# EAGLE schematic teleinfo2020 (EAGLE 9.1.0)
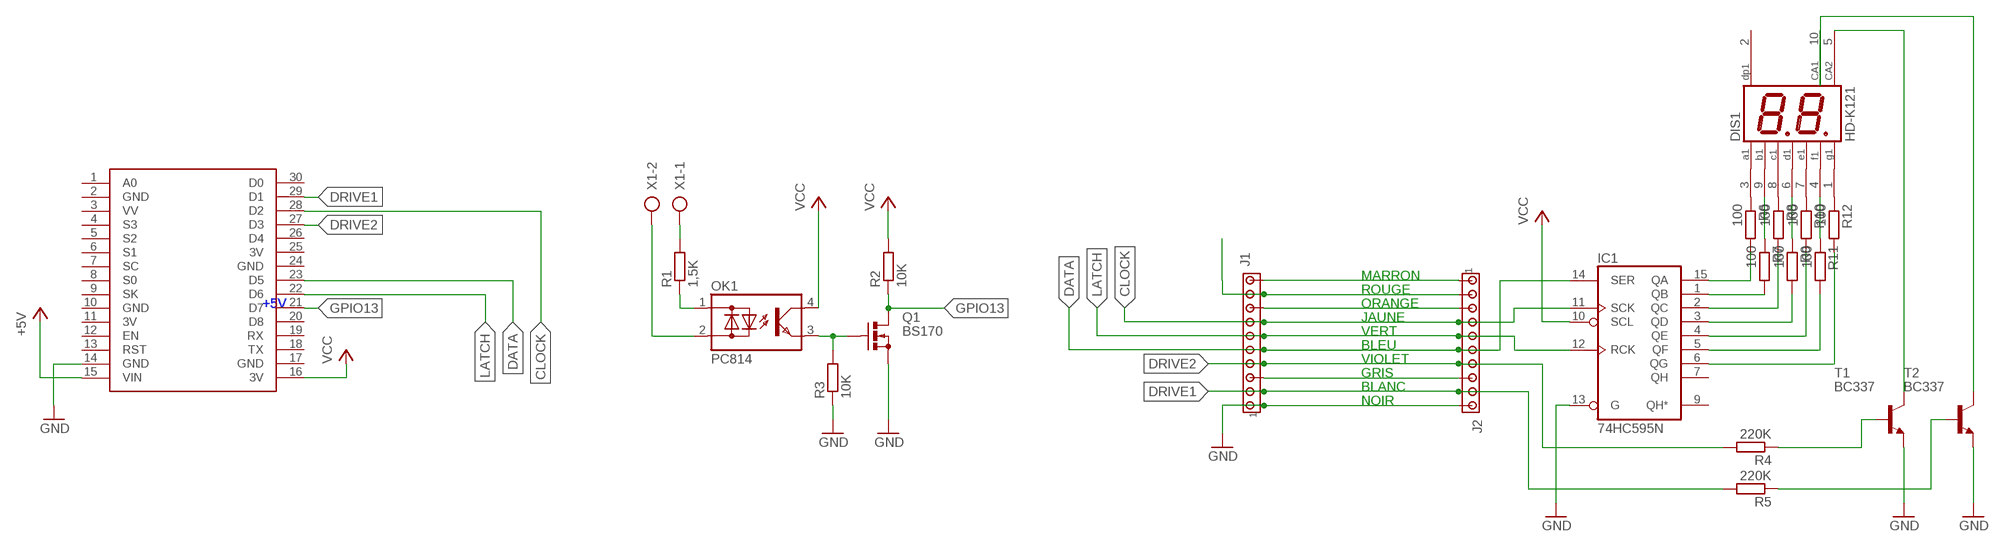
[diagram p0: schematic, sheet 1]

## Parts
DIS1  HD-K121  [HDSP-R]
IC1  74HC595N  [DIL16]
J1  MTA10-100  [10X10MTA]
J2  MTA10-100  [10X10MTA]
OK1  PC814  [DIL04]
Q1  BS170  [SOT54E]
R1  1,5K  R-EU_0204/7  [0204/7]
R2  10K  R-EU_0204/7  [0204/7]
R3  10K  R-EU_0204/7  [0204/7]
R4  220K  R-EU_0204/7  [0204/7]
R5  220K  R-EU_0204/7  [0204/7]
R6  100  R-EU_0204/7  [0204/7]
R7  100  R-EU_0204/7  [0204/7]
R8  100  R-EU_0204/7  [0204/7]
R9  100  R-EU_0204/7  [0204/7]
R10  100  R-EU_0204/7  [0204/7]
R11  100  R-EU_0204/7  [0204/7]
R12  100  R-EU_0204/7  [0204/7]
T1  BC337  [TO92]
T2  BC337  [TO92]
U$1  NODEMCU  [NODEMCU]
X1  AK300/2  [AK300/2]

## Nets
+5V: U$1.15(VIN)
CLOCK: IC1.11(SCK) J1.7 J2.4 U$1.28(D2)
DATA: IC1.14(SER) J1.5 J2.6 U$1.23(D5)
DRIVE1: J1.2 J2.9 R5.2 U$1.29(D1)
DRIVE2: J1.4 J2.7 R4.2 U$1.27(D3)
GND: IC1.13(G) J1.1 J2.10 Q1.S R3.1 T1.1(E) T2.1(E) U$1.14(GND)
GPIO13: Q1.D R2.1
LATCH: IC1.12(RCK) J1.6 J2.5 U$1.22(D6)
N$1: R1.2 X1.1
N$2: OK1.1(AC1) R1.1
N$3: OK1.2(AC2) X1.2
N$4: OK1.3(E) Q1.G R3.2
N$5: U$1.21(D7)
N$6: DIS1.5(CA2) T1.3(C)
N$7: J1.10 J2.1
N$8: IC1.15(QA) R6.2
N$9: J1.8 J2.3
N$10: DIS1.3(A1) R6.1
N$11: IC1.1(QB) R7.2
N$12: IC1.2(QC) R8.2
N$13: IC1.3(QD) R9.2
N$14: J1.3 J2.8
N$15: IC1.4(QE) R10.2
N$16: IC1.5(QF) R11.2
N$17: IC1.6(QG) R12.2
N$18: R4.1 T1.2(B)
N$19: R5.1 T2.2(B)
N$20: J1.9 J2.2
N$21: DIS1.10(CA1) T2.3(C)
N$22: DIS1.8(C1) R8.1
N$23: DIS1.7(E1) R10.1
N$24: DIS1.1(G1) R12.1
N$25: DIS1.9(B1) R7.1
N$26: DIS1.6(D1) R9.1
N$27: DIS1.4(F1) R11.1
VCC: IC1.10(SCL) OK1.4(C) R2.2 U$1.16(3V)
Unconnected: DIS1.2(DP1) IC1.7(QH) IC1.9(QH*) U$1.1(A0) U$1.3(VV) U$1.4(S3) U$1.5(S2) U$1.6(S1) U$1.7(SC) U$1.8(S0) U$1.9(SK) U$1.12(EN) U$1.13(RST) U$1.18(TX) U$1.19(RX) U$1.20(D8) U$1.26(D4) U$1.30(D0)

## Notes on the sheet
- MARRON
- ROUGE
- ORANGE
- JAUNE
- VERT
- BLEU
- VIOLET
- GRIS
- BLANC
- NOIR

## Power pins joined to a net without a drawn wire
3V: U$1.11(3V) U$1.25(3V)
GND: IC1.8(GND) U$1.2(GND) U$1.10(GND) U$1.17(GND) U$1.24(GND)
VCC: IC1.16(VCC)

## Library data of the parts
DIS1 = custom:HD-K121: LED DISPLAY 2 x 1 character 7 segment, decimal points right; OC_FARNELL: unknown; OC_NEWARK: unknown
IC1 = 74xx-eu:74*595: 8-bit SHIFT REGISTER, output latch
J1 J2 = con-amp:MTA10-100: AMP connector
OK1 = optocoupler:PC814: SHARP OPTO COUPLER; OC_FARNELL: 9707662; OC_NEWARK: unknown
Q1 = transistor-small-signal:BS170: N-CHANNEL MOS FET
R1-R12 = resistor:R-EU_: RESISTOR, European symbol
T1 T2 = transistor:BC337: NPN TRANSISTOR
U$1 = nodemcu:NODEMCU
X1 = con-ptr500:AK300/2: CONNECTOR; OC_FARNELL: unknown; OC_NEWARK: unknown